# EAGLE design Manchester1593J (EAGLE 7.7.0)
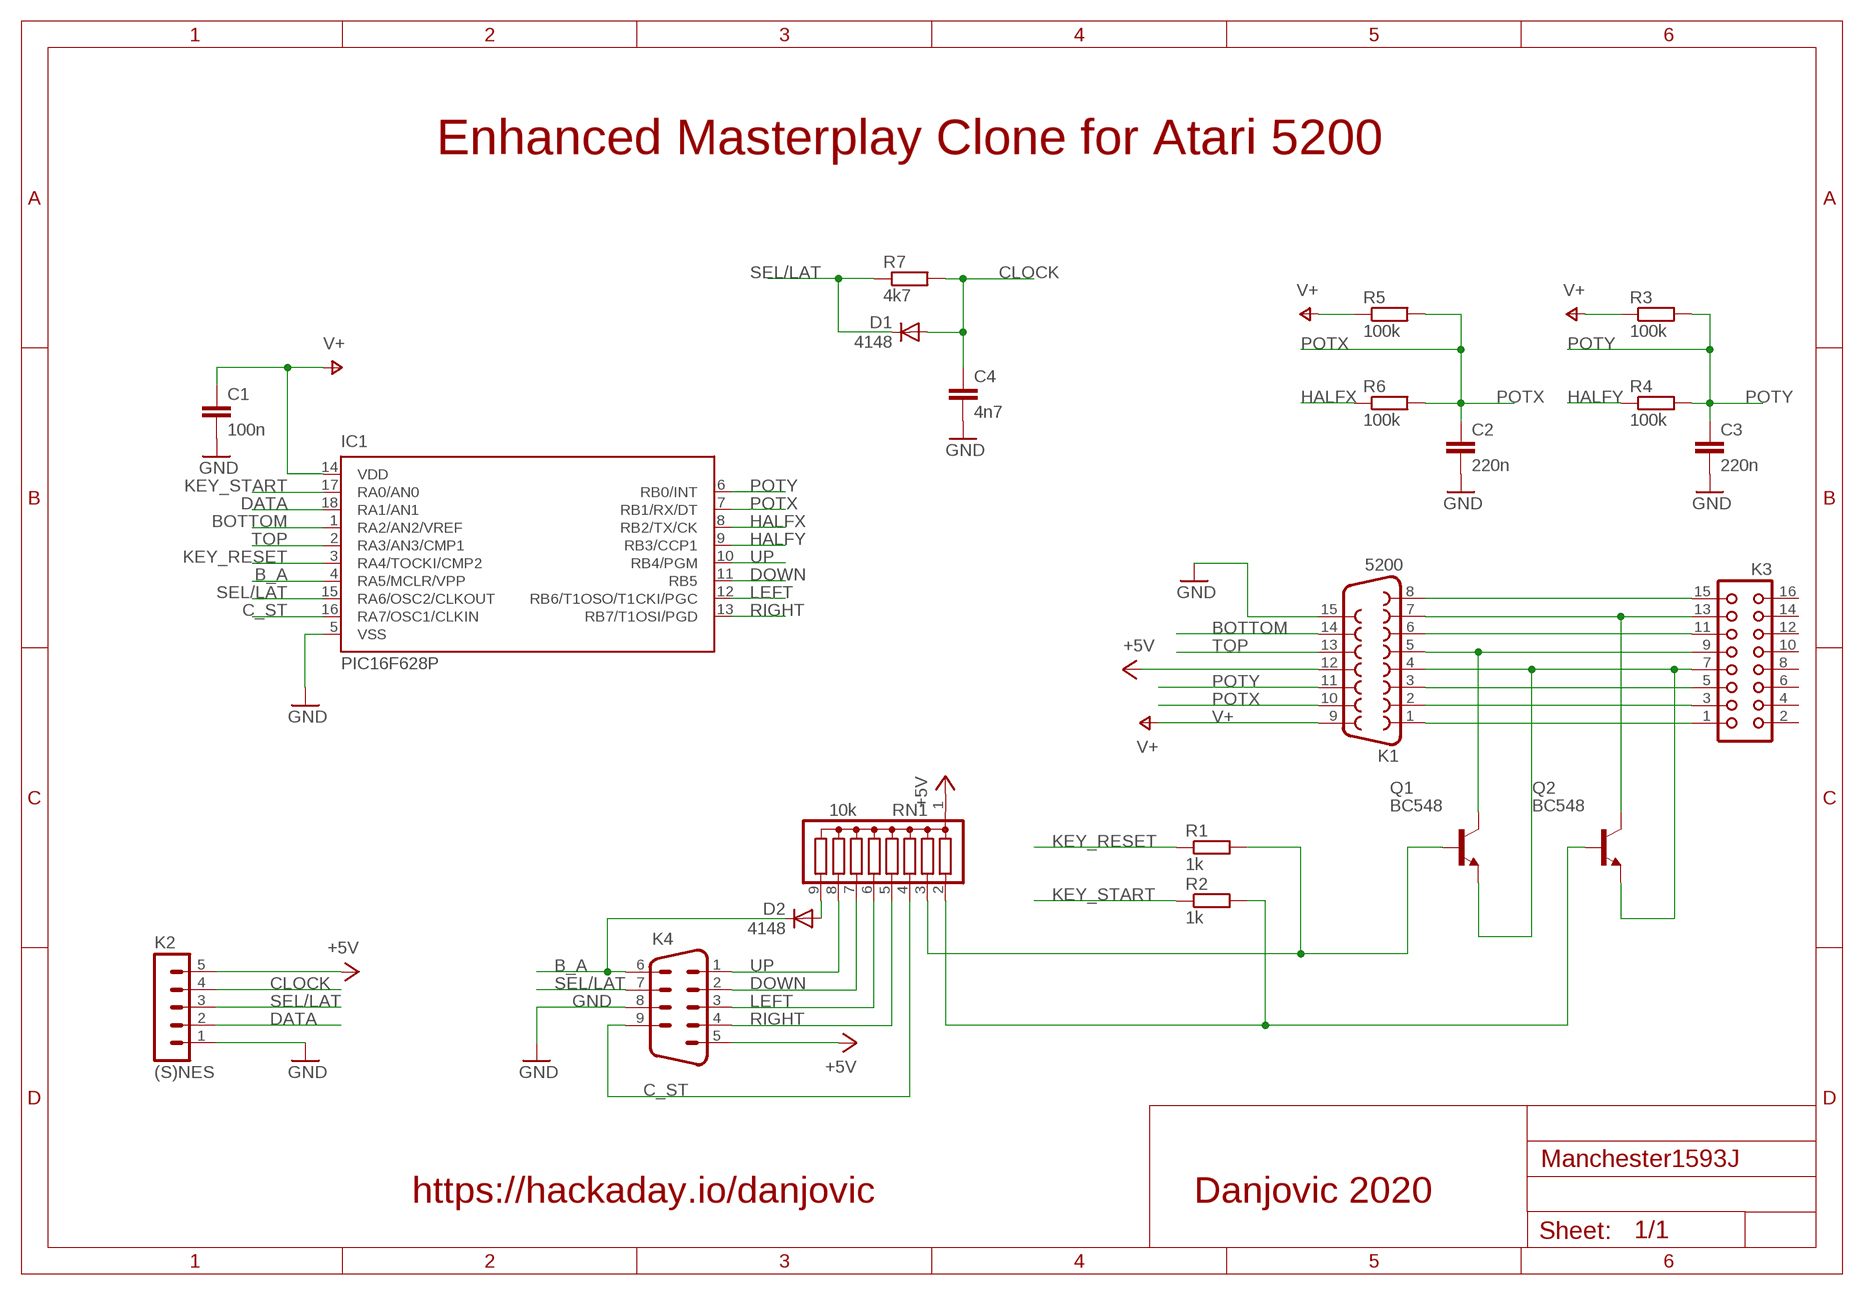
[diagram p0: schematic, sheet 1]

## Parts
C1  100n  C-EU050-024X044  [C050-024X044]
C2  220n  C-EU050-024X044  [C050-024X044]
C3  220n  C-EU050-024X044  [C050-024X044]
C4  4n7  C-EU050-024X044  [C050-024X044]
D1  4148  DIODE-D-5  [D-5]
D2  4148  DIODE-D-5  [D-5]
IC1  PIC16F628P  [DIL18]
K1  5200  F15H  [F15H]
K2  (S)NES  MA05-1  [MA05-1]
K3  CON16L  [CON16L]
K4  M09H  [M09H]
Q1  BC548  [TO92]
Q2  BC548  [TO92]
R1  1k  R-EU_0204/7  [0204/7]
R2  1k  R-EU_0204/7  [0204/7]
R3  100k  R-EU_0204/7  [0204/7]
R4  100k  R-EU_0204/7  [0204/7]
R5  100k  R-EU_0204/7  [0204/7]
R6  100k  R-EU_0204/7  [0204/7]
R7  4k7  R-EU_0204/7  [0204/7]
RN1  10k  G08R  [SIL9]

## Nets
+5V: K1.12 K2.5 K4.5 RN1.1
B_A: D2.C IC1.4(RA5/MCLR/VPP) K4.6
BOTTOM: IC1.1(RA2/AN2/VREF) K1.14
C_ST: IC1.16(RA7/OSC1/CLKIN) K4.9 RN1.4
CLOCK: C4.1 D1.A K2.4 R7.2
COL0: K1.7 K3.13 Q2.3(C)
COL1: K1.6 K3.11
COL2: K1.5 K3.9 Q1.3(C)
COL3: K1.8 K3.15
DATA: IC1.18(RA1/AN1) K2.2
DOWN: IC1.11(RB5) K4.2 RN1.7
GND: C1.2 C2.2 C3.2 C4.2 IC1.5(VSS) K1.15 K2.1 K4.8
HALFX: IC1.8(RB2/TX/CK) R6.1
HALFY: IC1.9(RB3/CCP1) R4.1
KEY_RESET: IC1.3(RA4/TOCKI/CMP2) R1.1
KEY_START: IC1.17(RA0/AN0) R2.1
LEFT: IC1.12(RB6/T1OSO/T1CKI/PGC) K4.3 RN1.6
N$1: Q1.2(B) R1.2 RN1.3
N$2: Q2.2(B) R2.2 RN1.2
N$3: D2.A RN1.9
POTX: C2.1 IC1.7(RB1/RX/DT) K1.10 R5.2 R6.2
POTY: C3.1 IC1.6(RB0/INT) K1.11 R3.2 R4.2
RIGHT: IC1.13(RB7/T1OSI/PGD) K4.4 RN1.5
ROW0: K1.3 K3.5
ROW1: K1.2 K3.3
ROW2: K1.1 K3.1
ROW3: K1.4 K3.7 Q1.1(E) Q2.1(E)
SEL/LAT: D1.C IC1.15(RA6/OSC2/CLKOUT) K2.3 K4.7 R7.1
TOP: IC1.2(RA3/AN3/CMP1) K1.13
UP: IC1.10(RB4/PGM) K4.1 RN1.8
V+: C1.1 IC1.14(VDD) K1.9 R3.1 R5.1
Unconnected: K3.2 K3.4 K3.6 K3.8 K3.10 K3.12 K3.14 K3.16

## Notes on the sheet
- Enhanced Masterplay Clone for Atari 5200
- https://hackaday.io/danjovic | Danjovic 2020

## Library data of the parts
C1-C4 = rcl:C-EU: CAPACITOR, European symbol
D1 D2 = diode:DIODE-: DIODE
IC1 = microchip:PIC16F62*: FLASH-Based 8-Bit CMOS Microcontroller Source: http://ww1.microchip.com/downloads/en/DeviceDoc/40300C.pdf; MF: MICROCHIP; MPN: PIC16F628-04I/P; OC_FARNELL: 9760407; OC_NEWARK: 19C7272
K1 = con-subd:F15: SUB-D; OC_FARNELL: unknown; OC_NEWARK: unknown
K2 = con-lstb:MA05-1: PIN HEADER; OC_FARNELL: unknown; OC_NEWARK: unknown
K3 = con-harting:CON16L: CONNECTOR; OC_FARNELL: unknown; OC_NEWARK: unknown
K4 = con-subd:M09: SUB-D; OC_FARNELL: unknown; OC_NEWARK: unknown
Q1 Q2 = Microdigital:BC548: NPN Transistor
R1-R7 = rcl:R-EU_: RESISTOR, European symbol
RN1 = resistor-sil:G08R: SIL RESISTOR; OC_FARNELL: unknown; OC_NEWARK: unknown

## Board
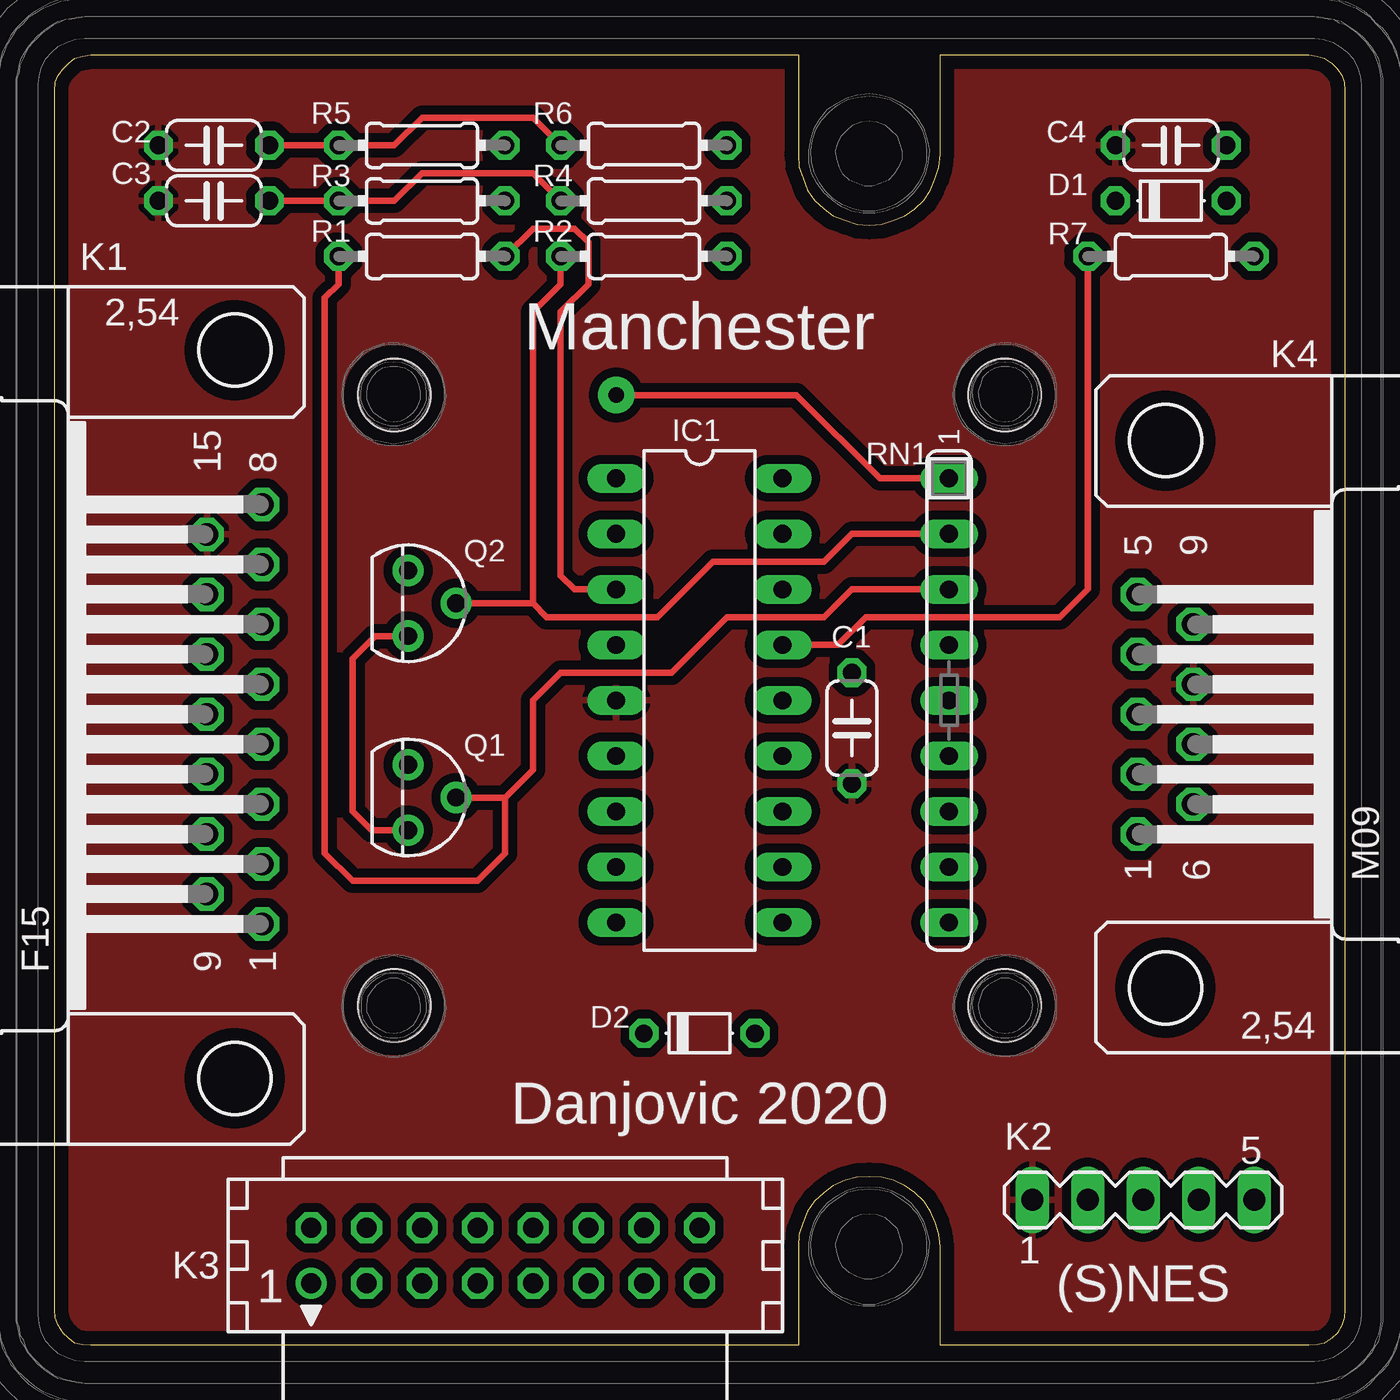
[diagram p1: board, top side]
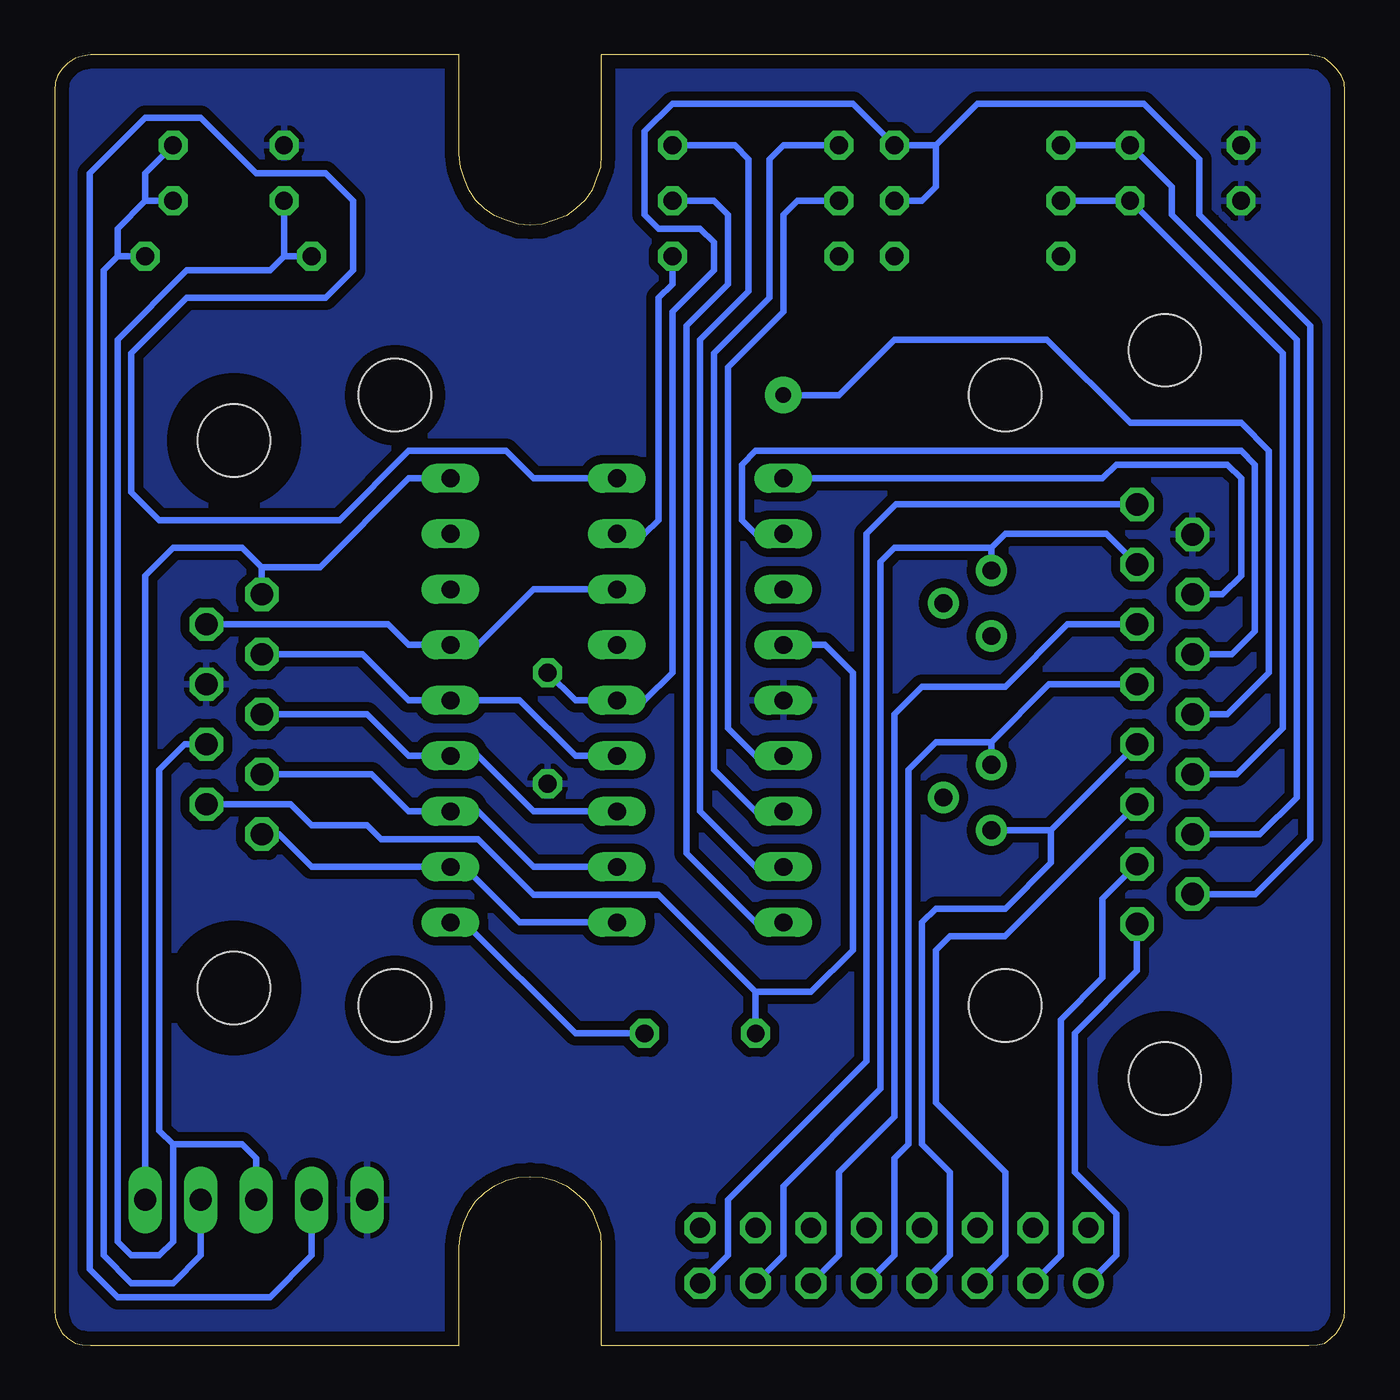
[diagram p2: board, bottom side, seen from below]

Size 59.07 x 59.07 mm. Coordinates in mm from the lower left corner, seen from the top.
Copper layers (1*16): Top 0.035mm / dielectric 1.5mm / Bottom 0.035mm
Design rules "default *": minimum track width 10mil, minimum drill 24mil, track to track 8mil, track to pad 8mil, pad to pad 8mil, via to via 8mil, smd to smd 8mil, copper to edge 25mil, drill to drill 8mil, minimum pad ring 10mil, minimum via ring 8mil, stop-mask expansion 4mil, vias tented up to drill 0mil, thermal gap 10mil

### Footprints (pad centres in the part's own frame; a part is rotated, then mirrored left to right if it is on the bottom)
C050-024X044 = drill 0.813 octagon: 1 -2.54,0; 2 2.54,0
D-5 = drill 0.813 octagon: A 2.54,0; C -2.54,0
DIL18 = drill 0.813 long: 1 -10.16,-3.81; 2 -7.62,-3.81; 3 -5.08,-3.81; 4 -2.54,-3.81; 5 0,-3.81; 6 2.54,-3.81; 7 5.08,-3.81; 8 7.62,-3.81; 9 10.16,-3.81; 10 10.16,3.81; 11 7.62,3.81; 12 5.08,3.81; 13 2.54,3.81; 14 0,3.81; 15 -2.54,3.81; 16 -5.08,3.81; 17 -7.62,3.81; 18 -10.16,3.81
F15H = drill 1.016 octagon: 1 -9.601,-1.27; 2 -6.858,-1.27; 3 -4.115,-1.27; 4 -1.372,-1.27; 5 1.372,-1.27; 6 4.115,-1.27; 7 6.858,-1.27; 8 9.601,-1.27; 9 -8.23,1.27; 10 -5.486,1.27; 11 -2.743,1.27; 12 0,1.27; 13 2.743,1.27; 14 5.486,1.27; 15 8.23,1.27 | hole 3.302: -16.662,0; 16.662,0
MA05-1 = drill 1.016 long: 1 -5.08,0; 2 -2.54,0; 3 0,0; 4 2.54,0; 5 5.08,0
CON16L = drill 0.914: 1 8.89,1.27 | drill 0.914 octagon: 2 8.89,-1.27; 3 6.35,1.27; 4 6.35,-1.27; 5 3.81,1.27; 6 3.81,-1.27; 7 1.27,1.27; 8 1.27,-1.27; 9 -1.27,1.27; 10 -1.27,-1.27; 11 -3.81,1.27; 12 -3.81,-1.27; 13 -6.35,1.27; 14 -6.35,-1.27; 15 -8.89,1.27; 16 -8.89,-1.27
M09H = drill 1.016 octagon: 1 -5.486,1.27; 2 -2.743,1.27; 3 0,1.27; 4 2.743,1.27; 5 5.486,1.27; 6 -4.115,-1.27; 7 -1.372,-1.27; 8 1.372,-1.27; 9 4.115,-1.27 | hole 3.302: 12.522,0; -12.522,0
TO92 = drill 0.813 pad 1.422: 1 1.5,0; 2 0,2.2; 3 -1.5,0
0204/7 = drill 0.813 octagon: 1 -3.81,0; 2 3.81,0
SIL9 = drill 0.813 long: 1 -10.16,0; 2 -7.62,0; 3 -5.08,0; 4 -2.54,0; 5 0,0; 6 2.54,0; 7 5.08,0; 8 7.62,0; 9 10.16,0
1593J = hole 3.302: -13.97,-13.97; 13.97,-13.97; -13.97,13.97; 13.97,13.97

### Placement (x,y rotation side)
C1  36.5,28.25 270 top
C2  7.29,54.92 180 top
C3  7.29,52.38 180 top
C4  51.11,54.92 180 top
D1  51.11,52.38 0 top
D2  29.52,14.28 0 top
IC1  29.52,29.52 270 top
K1  8.25,28.88 90 top
K2  49.84,6.66 0 top
K3  20.63,4.12 180 top
K4  50.85,28.88 90 top
Q1  16.18,25.07 270 top
Q2  16.18,33.96 270 top
R1  16.82,49.84 180 top
R2  26.98,49.84 180 top
R3  16.82,52.38 180 top
R4  26.98,52.38 180 top
R5  16.82,54.92 180 top
R6  26.98,54.92 180 top
R7  51.11,49.84 0 top
RN1  40.95,29.52 270 top
U$1  [1593J]  29.52,29.52 90 top

### Tracks (layer width: path | path; a pad name or v marks a point on that pad's centre or on a via)
+5V  (via drill 0.7 pad 1.68)
  Top 0.305: v25.71,43.49 33.96,43.49 37.77,39.68 RN1.1
  Bottom 0.305: K2.5 54.92,35.23 53.65,36.5 50.47,36.5 49.58,35.61 | K1.12 5.39,28.88 3.48,30.79 3.48,40.95 4.75,42.22 9.83,42.22 13.64,46.03 20.63,46.03 23.17,43.49 v25.71,43.49 | K4.5 49.58,35.61 | 49.58,35.61 46.92,35.61 42.85,39.68 RN1.1
B_A
  Bottom 0.305: K4.6 48.26,24.77 47.3,23.8 44.76,23.8 44.12,23.17 39.68,23.17 37.14,20.63 31.42,20.63 26.98,16.18 | 26.98,16.18 24.44,16.18 22.53,18.09 22.53,30.79 23.8,32.06 IC1.4 | D2.C 26.98,16.18
BOTTOM
  Bottom 0.305: K1.14 5.62,34.37 4.75,35.23 4.75,39.68 5.39,40.31 10.47,40.31 11.1,39.68 IC1.1
C_ST
  Bottom 0.305: K4.9 43.79,33 42.85,32.06 RN1.4 39.68,32.06 37.14,34.6 IC1.16
CLOCK
  Bottom 0.305: K2.4 52.38,4.12 53.65,2.85 55.55,2.85 56.82,4.12 56.82,49.2 56.19,49.84 | 56.19,49.84 R7.2 | C4.1 54.92,53.65 54.92,52.38 | 54.92,52.38 56.19,51.11 56.19,49.84 | D1.A 54.92,52.38
COL0
  Bottom 0.305: K3.13 25.71,4.12 25.71,7.29 21.26,11.74 21.26,35.87 20.63,36.5 16.18,36.5 | K1.7 10.91,37.14 15.55,37.14 16.18,36.5 | Q2.3 16.18,36.5
COL1
  Bottom 0.305: K3.11 23.17,4.12 23.17,7.93 20.63,10.47 20.63,28.88 19.36,30.15 15.55,30.15 12.7,33 K1.6
COL2
  Bottom 0.305: K3.9 20.63,4.12 20.63,8.56 19.99,9.2 19.99,26.34 18.72,27.61 16.18,27.61 | K1.5 13.54,30.25 16.18,27.61 | 16.18,27.61 Q1.3
COL3
  Bottom 0.305: K3.15 28.25,4.12 28.25,6.66 21.9,13.01 21.9,37.14 20.55,38.48 K1.8
DATA
  Bottom 0.305: K2.2 47.3,4.12 49.2,2.21 56.19,2.21 57.46,3.48 57.46,53.65 54.92,56.19 52.38,56.19 49.84,53.65 46.66,53.65 45.39,52.38 45.39,49.84 45.39,49.2 46.66,47.93 47.3,47.93 53.01,47.93 55.55,45.39 55.55,39.04 54.28,37.77 46.03,37.77 42.85,40.95 38.41,40.95 37.14,39.68 IC1.18
DOWN
  Bottom 0.305: K4.2 44.55,26.14 42.85,24.44 RN1.7 39.68,24.44 37.14,21.9 IC1.11
GND
  pour Bottom (isolate 0.406): -0.33,-0.33 -0.33,60.63 59.36,60.63 59.36,-0.33
  pour Top (isolate 0.406): -0.33,-0.33 -0.33,59.36 59.36,59.36 59.36,-0.33
HALFX
  Bottom 0.305: R6.1 27.93,54.92 27.29,54.28 27.29,48.25 29.52,46.03 29.52,24.44 26.98,21.9 IC1.8
HALFY
  Bottom 0.305: R4.1 28.88,52.38 28.25,51.74 28.25,48.57 30.15,46.66 30.15,22.53 26.98,19.36 IC1.9
KEY_RESET
  Top 0.305: R1.1 21.9,51.11 23.8,51.11 24.44,50.47 24.44,48.57 23.17,47.3 23.17,35.23 23.8,34.6 IC1.3
KEY_START
  Bottom 0.305: IC1.17 32.06,37.14 31.42,37.77 31.42,47.93 30.79,48.57 R2.1
LEFT
  Bottom 0.305: K4.3 44.76,28.88 42.85,26.98 RN1.6 39.68,26.98 37.14,24.44 IC1.12
N$1
  Top 0.305: RN1.3 36.5,34.6 35.23,33.33 30.79,33.33 28.25,30.79 23.17,30.79 21.9,29.52 21.9,26.34 20.63,25.07 | 20.63,25.07 Q1.2 | R1.2 13.01,48.57 12.37,47.93 12.37,22.53 13.64,21.26 19.36,21.26 20.63,22.53 20.63,25.07
N$2
  Top 0.305: Q2.2 21.9,33.96 | 21.9,33.96 22.53,33.33 27.61,33.33 30.15,35.87 35.23,35.87 36.5,37.14 RN1.2 | 21.9,33.96 21.9,47.3 23.17,48.57 R2.2
N$3
  Bottom 0.305: D2.A 35.23,14.28 40.31,19.36 RN1.9
POTX
  Top 0.305: R6.2 21.9,56.19 16.82,56.19 15.55,54.92 R5.2 C2.1
  Bottom 0.305: K1.10 3.89,23.4 2.21,25.07 2.21,46.03 7.93,51.74 7.93,53.01 C2.1 R5.2 | IC1.7 26.98,24.44 28.88,26.34 28.88,45.39 26.34,47.93 26.34,54.28 25.71,54.92 R6.2
POTY
  Top 0.305: R4.2 21.9,53.65 16.82,53.65 15.55,52.38 R3.2 C3.1
  Bottom 0.305: R3.2 C3.1 2.85,45.39 2.85,28.25 4.96,26.14 K1.11 | IC1.6 26.98,26.98 28.25,28.25 28.25,44.76 25.71,47.3 25.71,51.74 25.07,52.38 R4.2
RIGHT
  Bottom 0.305: K4.4 44.96,31.63 42.85,29.52 RN1.5 37.77,29.52 35.23,26.98 IC1.13
ROW0
  Bottom 0.305: 9.52,24.75 K1.3 15.56,18.72 18.09,18.72 18.72,18.09 18.72,11.1 15.55,7.93 15.55,4.12 K3.5
ROW1
  Bottom 0.305: K3.3 13.01,4.12 13.01,14.91 11.1,16.82 11.1,20.44 K1.2
ROW2
  Bottom 0.305: K1.1 9.52,17.14 12.37,14.28 12.37,7.93 10.47,6.02 10.47,4.12 K3.1
ROW3
  Top 0.305: Q2.1 14.68,32.46 13.64,31.42 13.64,24.44 14.51,23.57 Q1.1
  Bottom 0.305: K3.7 18.09,4.12 18.09,7.93 19.36,9.2 19.36,19.36 18.72,19.99 15.55,19.99 13.45,22.09 13.45,23.57 | K1.4 13.45,23.57 | 13.45,23.57 Q1.1
SEL/LAT
  Top 0.305: IC1.15 35.87,32.06 37.14,33.33 46.03,33.33 47.3,34.6 R7.1
  Bottom 0.305: K4.7 53.11,27.51 54.28,26.34 54.28,9.83 53.65,9.2 | 53.65,9.2 53.65,4.75 54.28,4.12 55.55,4.12 56.19,4.75 56.19,46.03 53.01,49.2 49.2,49.2 48.57,49.84 | R7.1 48.57,49.84 | K2.3 49.84,8.56 50.47,9.2 53.65,9.2 | D1.C 48.57,49.84
TOP
  Bottom 0.305: K1.13 5.18,31.63 4.12,32.69 4.12,40.31 4.75,40.95 26.98,40.95 27.61,40.31 27.61,37.77 26.98,37.14 IC1.2
UP
  Bottom 0.305: K4.1 48.8,23.4 47.3,21.9 RN1.8 40.31,21.9 37.77,19.36 IC1.10
V+
  Bottom 0.305: K1.9 4.09,20.65 1.58,23.17 1.58,46.66 6.66,51.74 6.66,54.28 9.2,56.82 16.82,56.82 18.72,54.92 | 18.72,54.92 R5.1 22.53,56.82 30.79,56.82 32.06,55.55 32.06,51.74 31.42,51.11 29.52,51.11 28.88,50.47 28.88,49.2 30.79,47.3 30.79,30.79 32.06,29.52 IC1.14 35.23,29.52 C1.1 | R3.1 19.36,52.38 18.72,53.01 18.72,54.92

### Text on the board
tPlace: Manchester
tNames: Danjovic 2020 | (S)NES